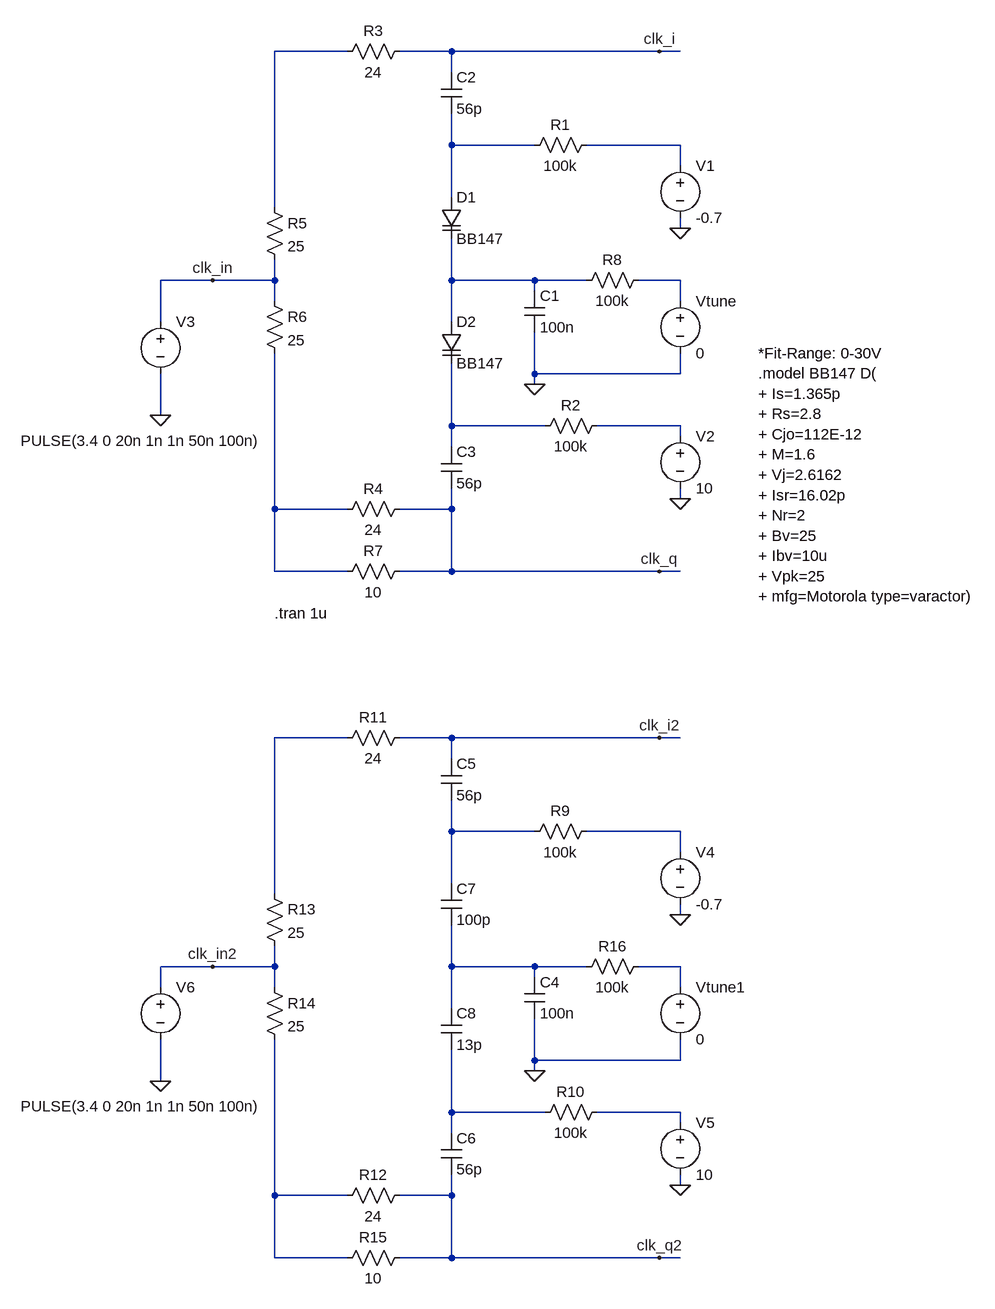
[diagram p0: schematic clock_skew_vtune_0V.asc]
clock_skew_vtune_0V.asc, the LTspice schematic file:
Version 4
SHEET 1 1252 1696
WIRE 16 -240 -96 -240
WIRE 176 -240 96 -240
WIRE 496 -240 176 -240
WIRE 528 -240 496 -240
WIRE 176 -208 176 -240
WIRE 176 -96 176 -144
WIRE 304 -96 176 -96
WIRE 528 -96 384 -96
WIRE 528 -64 528 -96
WIRE 176 -16 176 -96
WIRE -96 0 -96 -240
WIRE 528 32 528 16
WIRE -192 112 -272 112
WIRE -96 112 -96 80
WIRE -96 112 -192 112
WIRE 176 112 176 48
WIRE 304 112 176 112
WIRE 384 112 304 112
WIRE 528 112 464 112
WIRE 304 128 304 112
WIRE -96 144 -96 112
WIRE 528 144 528 112
WIRE -272 176 -272 112
WIRE 176 176 176 112
WIRE 304 256 304 192
WIRE 528 256 528 224
WIRE 528 256 304 256
WIRE 304 272 304 256
WIRE -272 320 -272 256
WIRE 176 336 176 240
WIRE 320 336 176 336
WIRE 528 336 400 336
WIRE 528 352 528 336
WIRE 176 368 176 336
WIRE 528 448 528 432
WIRE -96 464 -96 224
WIRE 16 464 -96 464
WIRE 176 464 176 432
WIRE 176 464 96 464
WIRE -96 560 -96 464
WIRE 16 560 -96 560
WIRE 176 560 176 464
WIRE 176 560 96 560
WIRE 496 560 176 560
WIRE 528 560 496 560
WIRE 16 816 -96 816
WIRE 176 816 96 816
WIRE 496 816 176 816
WIRE 528 816 496 816
WIRE 176 848 176 816
WIRE 176 960 176 912
WIRE 304 960 176 960
WIRE 528 960 384 960
WIRE 528 992 528 960
WIRE 176 1040 176 960
WIRE -96 1056 -96 816
WIRE 528 1088 528 1072
WIRE -192 1168 -272 1168
WIRE -96 1168 -96 1136
WIRE -96 1168 -192 1168
WIRE 176 1168 176 1104
WIRE 304 1168 176 1168
WIRE 384 1168 304 1168
WIRE 528 1168 464 1168
WIRE 304 1184 304 1168
WIRE -272 1200 -272 1168
WIRE -96 1200 -96 1168
WIRE 528 1200 528 1168
WIRE 176 1232 176 1168
WIRE 304 1312 304 1248
WIRE 528 1312 528 1280
WIRE 528 1312 304 1312
WIRE 304 1328 304 1312
WIRE -272 1344 -272 1280
WIRE 176 1392 176 1296
WIRE 320 1392 176 1392
WIRE 528 1392 400 1392
WIRE 528 1408 528 1392
WIRE 176 1424 176 1392
WIRE 528 1504 528 1488
WIRE -96 1520 -96 1280
WIRE 16 1520 -96 1520
WIRE 176 1520 176 1488
WIRE 176 1520 96 1520
WIRE -96 1616 -96 1520
WIRE 16 1616 -96 1616
WIRE 176 1616 176 1520
WIRE 176 1616 96 1616
WIRE 496 1616 176 1616
WIRE 528 1616 496 1616
FLAG 528 32 0
FLAG 528 448 0
FLAG 304 272 0
FLAG -272 320 0
FLAG 496 -240 clk_i
FLAG 496 560 clk_q
FLAG -192 112 clk_in
FLAG 528 1088 0
FLAG 528 1504 0
FLAG 304 1328 0
FLAG 496 816 clk_i2
FLAG 496 1616 clk_q2
FLAG -192 1168 clk_in2
FLAG -272 1344 0
SYMBOL varactor 160 -16 R0
SYMATTR InstName D1
SYMATTR Value BB147
SYMATTR Type diode
SYMBOL voltage 528 -80 R0
WINDOW 123 0 0 Left 0
WINDOW 39 0 0 Left 0
SYMATTR InstName V1
SYMATTR Value -0.7
SYMBOL res 400 -112 R90
WINDOW 0 0 56 VBottom 2
WINDOW 3 32 56 VTop 2
SYMATTR InstName R1
SYMATTR Value 100k
SYMBOL varactor 160 176 R0
SYMATTR InstName D2
SYMATTR Value BB147
SYMATTR Type diode
SYMBOL voltage 528 336 R0
WINDOW 123 0 0 Left 0
WINDOW 39 0 0 Left 0
SYMATTR InstName V2
SYMATTR Value 10
SYMBOL res 416 320 R90
WINDOW 0 0 56 VBottom 2
WINDOW 3 32 56 VTop 2
SYMATTR InstName R2
SYMATTR Value 100k
SYMBOL cap 288 128 R0
SYMATTR InstName C1
SYMATTR Value 100n
SYMBOL voltage 528 128 R0
SYMATTR InstName Vtune
SYMATTR Value 0
SYMBOL cap 160 -208 R0
SYMATTR InstName C2
SYMATTR Value 56p
SYMBOL cap 160 368 R0
SYMATTR InstName C3
SYMATTR Value 56p
SYMBOL res 112 -256 R90
WINDOW 0 0 56 VBottom 2
WINDOW 3 32 56 VTop 2
SYMATTR InstName R3
SYMATTR Value 24
SYMBOL res 112 448 R90
WINDOW 0 0 56 VBottom 2
WINDOW 3 32 56 VTop 2
SYMATTR InstName R4
SYMATTR Value 24
SYMBOL res -112 -16 R0
SYMATTR InstName R5
SYMATTR Value 25
SYMBOL res -112 128 R0
SYMATTR InstName R6
SYMATTR Value 25
SYMBOL res 112 544 R90
WINDOW 0 0 56 VBottom 2
WINDOW 3 32 56 VTop 2
SYMATTR InstName R7
SYMATTR Value 10
SYMBOL voltage -272 160 R0
WINDOW 3 -215 199 Left 2
WINDOW 123 0 0 Left 0
WINDOW 39 0 0 Left 0
SYMATTR InstName V3
SYMATTR Value PULSE(3.4 0 20n 1n 1n 50n 100n)
SYMBOL res 480 96 R90
WINDOW 0 0 56 VBottom 2
WINDOW 3 32 56 VTop 2
SYMATTR InstName R8
SYMATTR Value 100k
SYMBOL voltage 528 976 R0
WINDOW 123 0 0 Left 0
WINDOW 39 0 0 Left 0
SYMATTR InstName V4
SYMATTR Value -0.7
SYMBOL res 400 944 R90
WINDOW 0 0 56 VBottom 2
WINDOW 3 32 56 VTop 2
SYMATTR InstName R9
SYMATTR Value 100k
SYMBOL voltage 528 1392 R0
WINDOW 123 0 0 Left 0
WINDOW 39 0 0 Left 0
SYMATTR InstName V5
SYMATTR Value 10
SYMBOL res 416 1376 R90
WINDOW 0 0 56 VBottom 2
WINDOW 3 32 56 VTop 2
SYMATTR InstName R10
SYMATTR Value 100k
SYMBOL cap 288 1184 R0
SYMATTR InstName C4
SYMATTR Value 100n
SYMBOL voltage 528 1184 R0
SYMATTR InstName Vtune1
SYMATTR Value 0
SYMBOL cap 160 848 R0
SYMATTR InstName C5
SYMATTR Value 56p
SYMBOL cap 160 1424 R0
SYMATTR InstName C6
SYMATTR Value 56p
SYMBOL res 112 800 R90
WINDOW 0 0 56 VBottom 2
WINDOW 3 32 56 VTop 2
SYMATTR InstName R11
SYMATTR Value 24
SYMBOL res 112 1504 R90
WINDOW 0 0 56 VBottom 2
WINDOW 3 32 56 VTop 2
SYMATTR InstName R12
SYMATTR Value 24
SYMBOL res -112 1040 R0
SYMATTR InstName R13
SYMATTR Value 25
SYMBOL res -112 1184 R0
SYMATTR InstName R14
SYMATTR Value 25
SYMBOL res 112 1600 R90
WINDOW 0 0 56 VBottom 2
WINDOW 3 32 56 VTop 2
SYMATTR InstName R15
SYMATTR Value 10
SYMBOL res 480 1152 R90
WINDOW 0 0 56 VBottom 2
WINDOW 3 32 56 VTop 2
SYMATTR InstName R16
SYMATTR Value 100k
SYMBOL cap 160 1040 R0
SYMATTR InstName C7
SYMATTR Value 100p
SYMBOL cap 160 1232 R0
SYMATTR InstName C8
SYMATTR Value 13p
SYMBOL voltage -272 1184 R0
WINDOW 3 -215 199 Left 2
WINDOW 123 0 0 Left 0
WINDOW 39 0 0 Left 0
SYMATTR InstName V6
SYMATTR Value PULSE(3.4 0 20n 1n 1n 50n 100n)
TEXT -96 624 Left 2 !.tran 1u
TEXT 648 224 Left 2 !*Fit-Range: 0-30V\n.model BB147 D(\n+ Is=1.365p\n+ Rs=2.8\n+ Cjo=112E-12\n+ M=1.6\n+ Vj=2.6162\n+ Isr=16.02p\n+ Nr=2\n+ Bv=25\n+ Ibv=10u\n+ Vpk=25\n+ mfg=Motorola type=varactor)

The netlist it stands for:
* clock_skew_vtune_0V.asc
D1 N002 N004 BB147
V1 N003 0 -0.7
R1 N003 N002 100k
D2 N004 N006 BB147
V2 N007 0 10
R2 N007 N006 100k
C1 N004 0 100n
Vtune N005 0 0
C2 clk_i N002 56p
C3 N006 clk_q 56p
R3 clk_i N001 24
R4 clk_q N008 24
R5 N001 clk_in 25
R6 clk_in N008 25
R7 clk_q N008 10
V3 clk_in 0 PULSE(3.4 0 20n 1n 1n 50n 100n)
R8 N005 N004 100k
V4 N011 0 -0.7
R9 N011 N010 100k
V5 N015 0 10
R10 N015 N014 100k
C4 N012 0 100n
Vtune1 N013 0 0
C5 clk_i2 N010 56p
C6 N014 clk_q2 56p
R11 clk_i2 N009 24
R12 clk_q2 N016 24
R13 N009 clk_in2 25
R14 clk_in2 N016 25
R15 clk_q2 N016 10
R16 N013 N012 100k
C7 N010 N012 100p
C8 N012 N014 13p
V6 clk_in2 0 PULSE(3.4 0 20n 1n 1n 50n 100n)
.model D D
.lib standard.dio
.tran 1u
*Fit-Range: 0-30V
.model BB147 D(
+ Is=1.365p
+ Rs=2.8
+ Cjo=112E-12
+ M=1.6
+ Vj=2.6162
+ Isr=16.02p
+ Nr=2
+ Bv=25
+ Ibv=10u
+ Vpk=25
+ mfg=Motorola type=varactor)
.backanno
.end